# EAGLE design prototype (EAGLE 7.4.0)
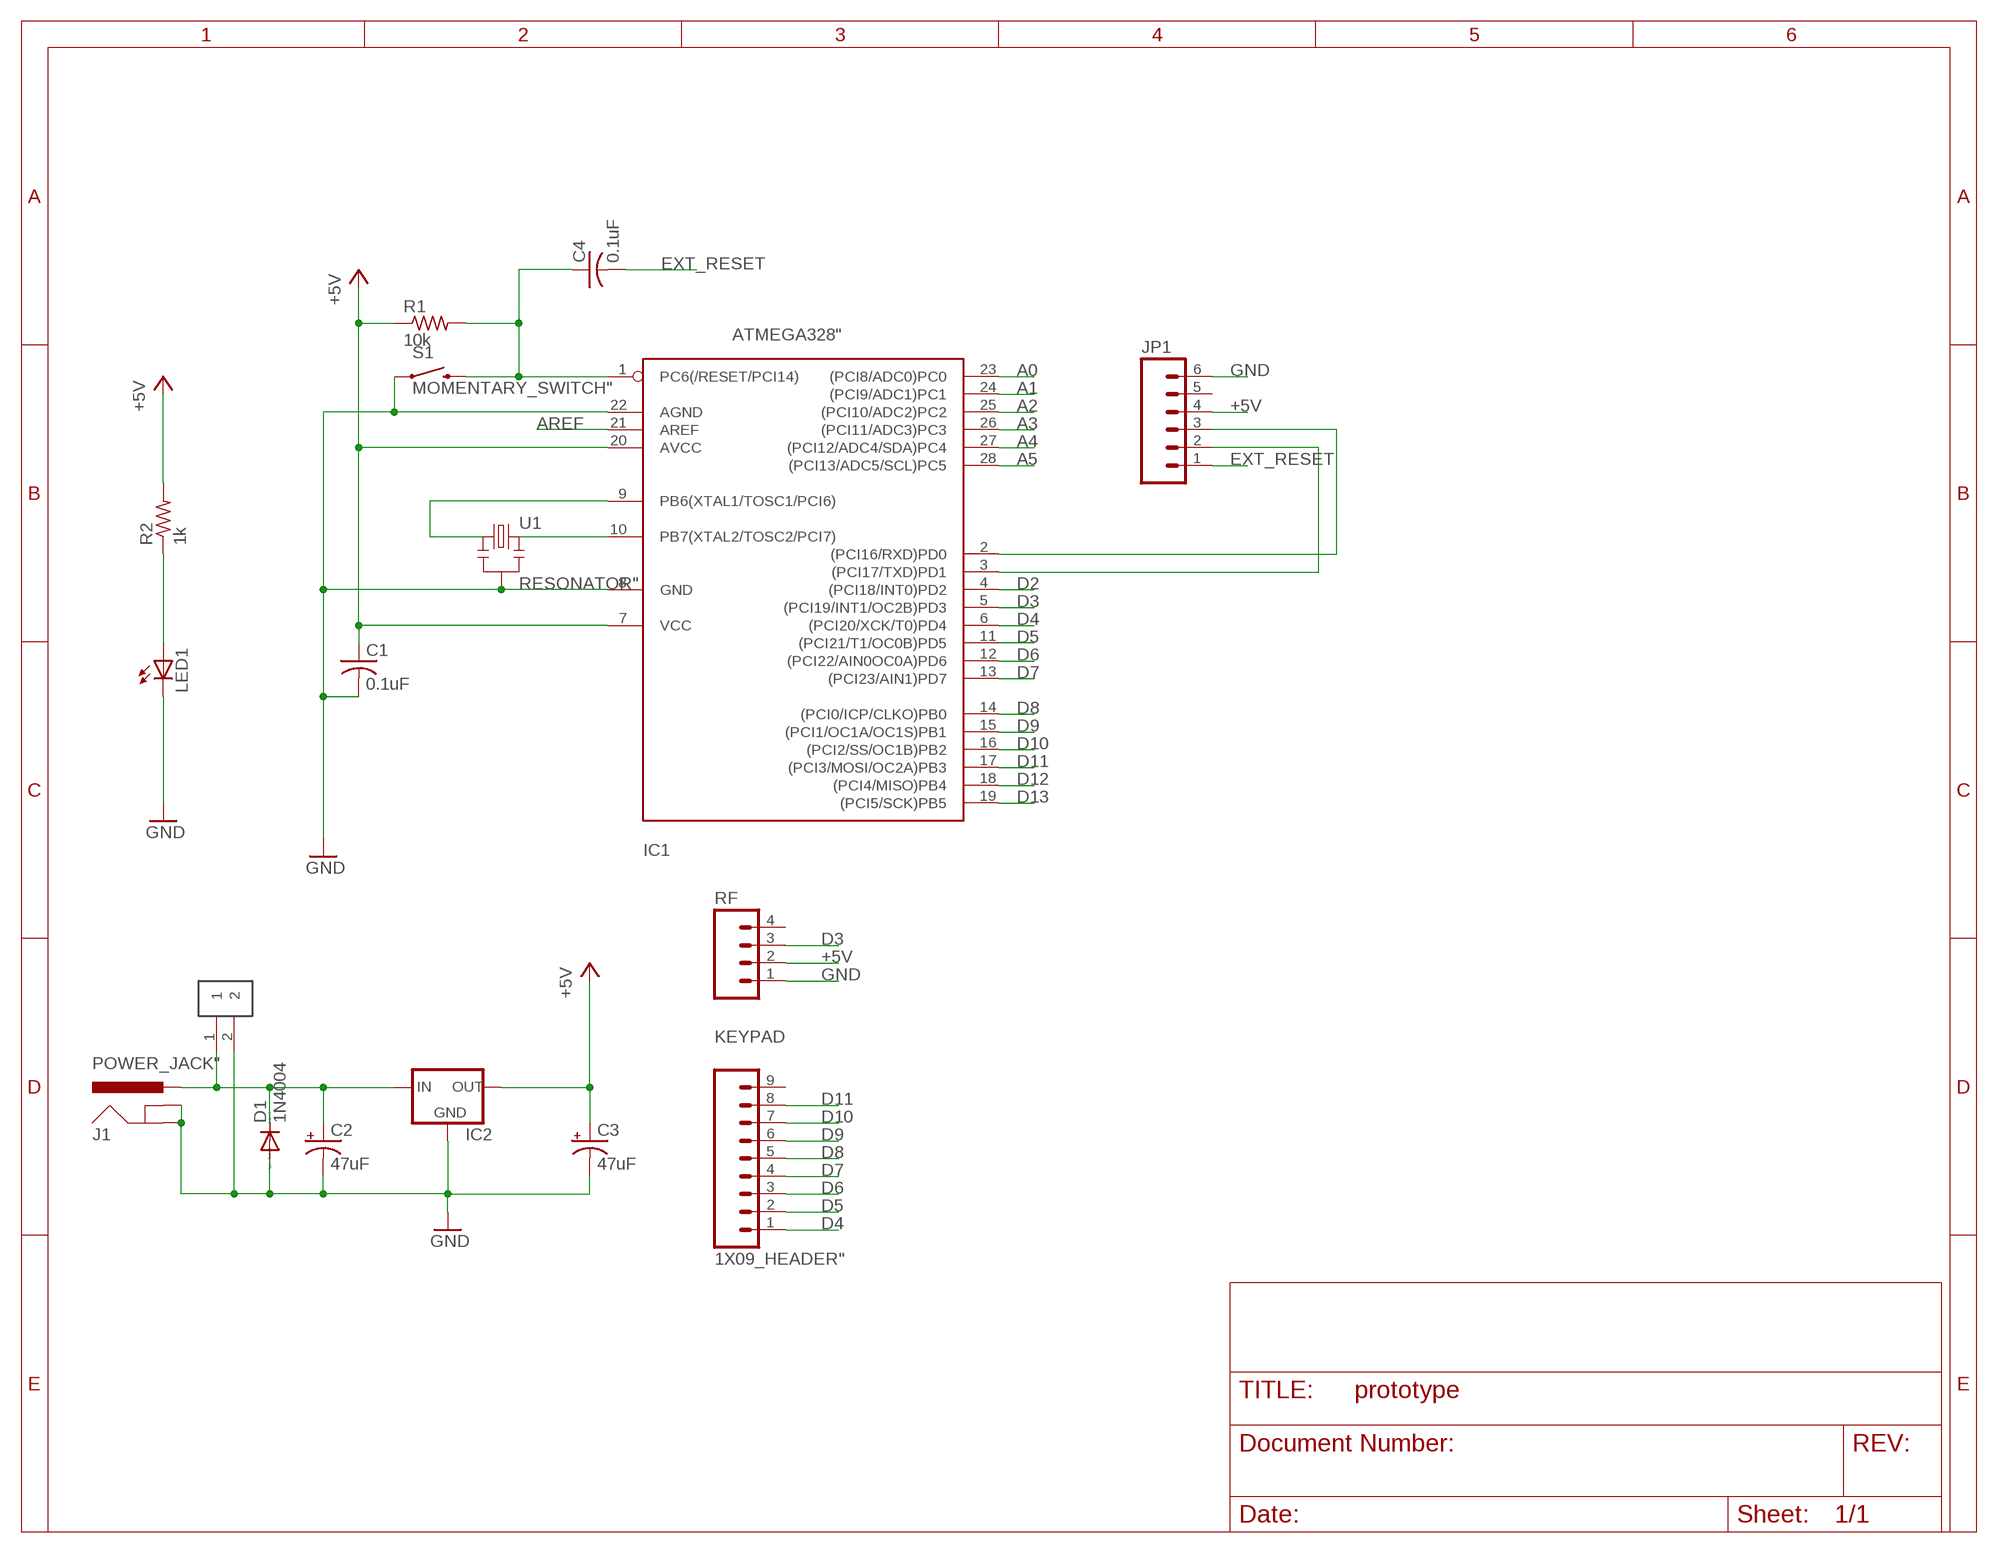
[diagram p0: schematic, sheet 1]

## Parts
C1  0.1uF  UNPOLARIZED_CAP"  [UNPOLARIZED_CAP]
C2  47uF  ELECTROLYTIC_CAP2.54MM  [ELECTROLYTIC_CAP]
C3  47uF  ELECTROLYTIC_CAP2.54MM  [ELECTROLYTIC_CAP]
C4  0.1uF  UNPOLARIZED_CAP"  [UNPOLARIZED_CAP]
D1  1N4004  [DO41-10]
IC1  ATMEGA328"  [ATMEGA328]
IC2  REGULATOR  [L4931_REGULATOR]
J1  POWER_JACK"  [POWER_JACK]
JP1  1X06_HEADER"  [1X06_HEADER]
KEYPAD  1X09_HEADER"  [1X09_HEADER]
LED1  LED3MM  [LED]
R1  10k  RESISTOR1/6WATT  [RESISTOR]
R2  1k  RESISTOR1/6WATT  [RESISTOR]
RF  1X04_HEADER"  [1X04_HEADER]
S1  MOMENTARY_SWITCH"  [MOMENTARY_SWITCH]
U1  RESONATOR"  [RESONATOR]
U$1  1X02_HEADER  [1X02_HEADER]

## Nets
+5V: C1.1 C3.+ IC1.7(VCC) IC1.20(AVCC) IC2.OUT JP1.4 R1.1 R2.2 RF.2
A0: IC1.23((PCI8/ADC0)PC0)
A1: IC1.24((PCI9/ADC1)PC1)
A2: IC1.25((PCI10/ADC2)PC2)
A3: IC1.26((PCI11/ADC3)PC3)
A4: IC1.27((PCI12/ADC4/SDA)PC4)
A5: IC1.28((PCI13/ADC5/SCL)PC5)
AREF: IC1.21(AREF)
D2: IC1.4((PCI18/INT0)PD2)
D3: IC1.5((PCI19/INT1/OC2B)PD3) RF.3
D4: IC1.6((PCI20/XCK/T0)PD4) KEYPAD.1
D5: IC1.11((PCI21/T1/OC0B)PD5) KEYPAD.2
D6: IC1.12((PCI22/AIN0OC0A)PD6) KEYPAD.3
D7: IC1.13((PCI23/AIN1)PD7) KEYPAD.4
D8: IC1.14((PCI0/ICP/CLKO)PB0) KEYPAD.5
D9: IC1.15((PCI1/OC1A/OC1S)PB1) KEYPAD.6
D10: IC1.16((PCI2/SS/OC1B)PB2) KEYPAD.7
D11: IC1.17((PCI3/MOSI/OC2A)PB3) KEYPAD.8
D12: IC1.18((PCI4/MISO)PB4)
D13: IC1.19((PCI5/SCK)PB5)
EXT_RESET: C4.2 JP1.1
GND: C1.2 C2.- C3.- D1.A IC1.8(GND) IC1.22(AGND) IC2.GND J1.GND J1.GNDBREAK JP1.6 LED1.K(C) RF.1 S1.1 U1.2 U$1.2
N$1: IC1.9(PB6(XTAL1/TOSC1/PCI6)) U1.1
N$2: IC1.10(PB7(XTAL2/TOSC2/PCI7)) U1.3
N$3: LED1.A R2.1
N$4: C4.1 IC1.1(PC6(/RESET/PCI14)) R1.2 S1.3
N$5: C2.+ D1.C IC2.IN J1.PWR U$1.1
N$7: IC1.2((PCI16/RXD)PD0) JP1.3
N$8: IC1.3((PCI17/TXD)PD1) JP1.2
Unconnected: JP1.5 KEYPAD.9 RF.4

## Library data of the parts
C1 C4 = RBBB:UNPOLARIZED_CAP: CAPACITOR, American symbol
C2 C3 = RBBB:ELECTROLYTIC_CAP: POLARIZED CAPACITOR, American symbol
D1 = diode:1N4004: DIODE general purpose rectifier, 1 A
IC1 = RBBB:ATMEGA328: MICROCONTROLLER 16 kBytes FLASH 1 kBytes SRAM 512 Bytes EEPROM USART 8-channel 10 bit ADC
IC2 = RBBB:REGULATOR: VOLTAGE REGULATOR
J1 = RBBB:POWER_JACK: Power Jack This is the standard 5.5mm barrel jack for power. The PTH is the most common, proven, reliable, footprint. All others are experimental. The Slot footprint only works if the mill layer is transmitted to the PCB fab house so be warned. Spark Fun Electronics SKU : PRT-00119. Mating wall wart : TOL-00298 (and others)
JP1 = RBBB:1X06_HEADER
KEYPAD = RBBB:1X09_HEADER: Header 9 Standard 9-pin 0.1" header. Use with straight break away headers (SKU : PRT-00116), right angle break away headers (PRT-00553), swiss pins (PRT-00743), machine pins (PRT-00117), and female headers (PRT-00115).
LED1 = RBBB:LED: LED OSRAM: - CHIPLED LG R971, LG N971, LY N971, LG Q971, LY Q971, LO R971, LY R971 LH N974, LH R974 LS Q976, LO Q976, LY Q976 LO Q996 - Hyper CHIPLED LW Q18S LB Q993, LB Q99A, LB R99A - SideLED LS A670, LO A670, LY A670, LG A670, LP A670 LB A673, LV A673, LT A673, LW A673 LH A674 LY A675 LS A676, LA A676, LO A676, LY A676, LW A676 LS A679, LY A679, LG A679 - Hyper Micro SIDELED® LS Y876, LA Y876, LO Y876, LY Y876 LT Y87S - SmartLED LW L88C, LW L88S LB L89C, LB L89S, LG L890 LS L89K, LO L89K, LY L89K LS L896, LA L896, LO L896, LY L896 - TOPLED LS T670, LO T670, LY T670, LG T670, LP T670 LSG T670, LSP T670, LSY T670, LOP T670, LYG T670 LG T671, LOG T671, LSG T671 LB T673, LV T673, LT T673, LW T673 LH T674 LS T676, LA T676, LO T676, LY T676, LB T676, LH T676, LSB T676, LW T676 LB T67C, LV T67C, LT T67C, LS T67K, LO T67K, LY T67K, LW E67C LS E67B, LA E67B, LO E67B, LY E67B, LB E67C, LV E67C, LT E67C LW T67C LS T679, LY T679, LG T679 LS T770, LO T770, LY T770, LG T770, LP T770 LB T773, LV T773, LT T773, LW T773 LH T774 LS E675, LA E675, LY E675, LS T675 LS T776, LA T776, LO T776, LY T776, LB T776 LHGB T686 LT T68C, LB T68C - Hyper Mini TOPLED® LB M676 - Mini TOPLED Santana® LG M470 LS M47K, LO M47K, LY M47K Source: http://www.osram.convergy.de LUXEON: - LUMILED® LXK2-PW12-R00, LXK2-PW12-S00, LXK2-PW14-U00, LXK2-PW14-V00 LXK2-PM12-R00, LXK2-PM12-S00, LXK2-PM14-U00 LXK2-PE12-Q00, LXK2-PE12-R00, LXK2-PE12-S00, LXK2-PE14-T00, LXK2-PE14-U00 LXK2-PB12-K00, LXK2-PB12-L00, LXK2-PB12-M00, LXK2-PB14-N00, LXK2-PB14-P00, LXK2-PB14-Q00 LXK2-PR12-L00, LXK2-PR12-M00, LXK2-PR14-Q00, LXK2-PR14-R00 LXK2-PD12-Q00, LXK2-PD12-R00, LXK2-PD12-S00 LXK2-PH12-R00, LXK2-PH12-S00 LXK2-PL12-P00, LXK2-PL12-Q00, LXK2-PL12-R00 Source: www.luxeon.com KINGBRIGHT: KA-3528ASYC Source: www.kingbright.com
R1 R2 = RBBB:RESISTOR: RESISTOR, American symbol
RF = RBBB:1X04_HEADER: Header 4 Standard 4-pin 0.1" header. Use with straight break away headers (SKU : PRT-00116), right angle break away headers (PRT-00553), swiss pins (PRT-00743), machine pins (PRT-00117), and female headers (PRT-00115). Molex polarized connector foot print use with SKU : PRT-08231 with associated crimp pins and housings.
S1 = RBBB:MOMENTARY_SWITCH
U1 = RBBB:RESONATOR: Resonator Small SMD resonator. This is the itty bitty 10/20MHz resonators with built in caps. CSTCE10M0G55 and CSTCE20M0V53. Footprint has been reviewed closely but hasn t been tested yet.'
U$1 = RBBB:1X02_HEADER

## Board
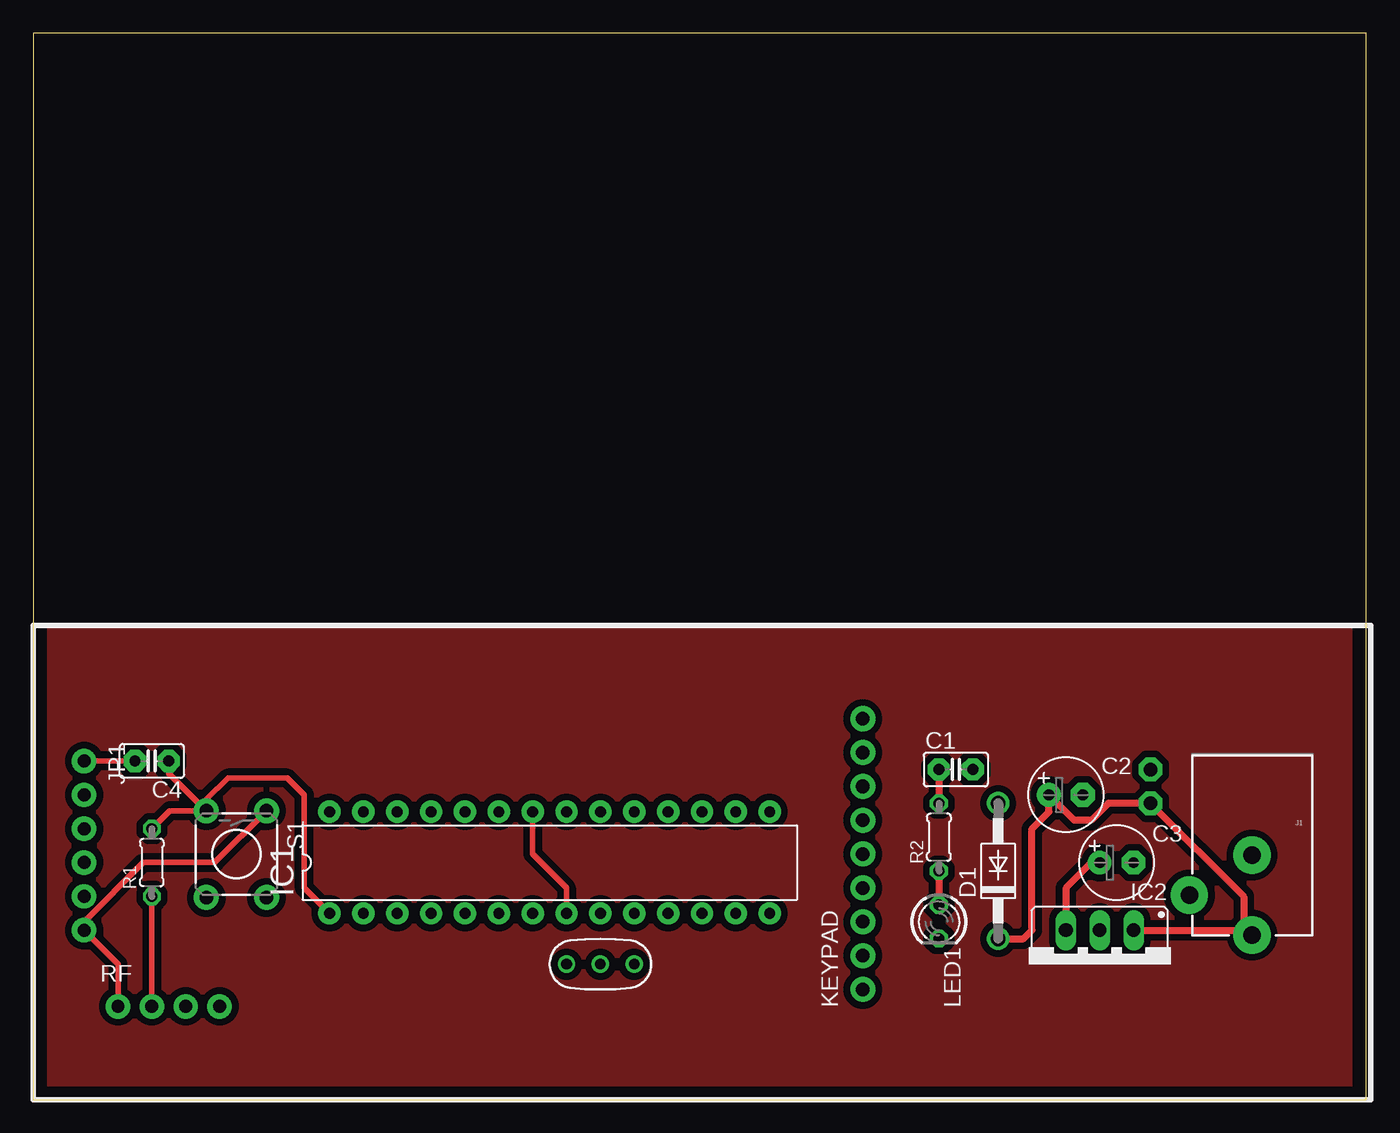
[diagram p1: board, top side]
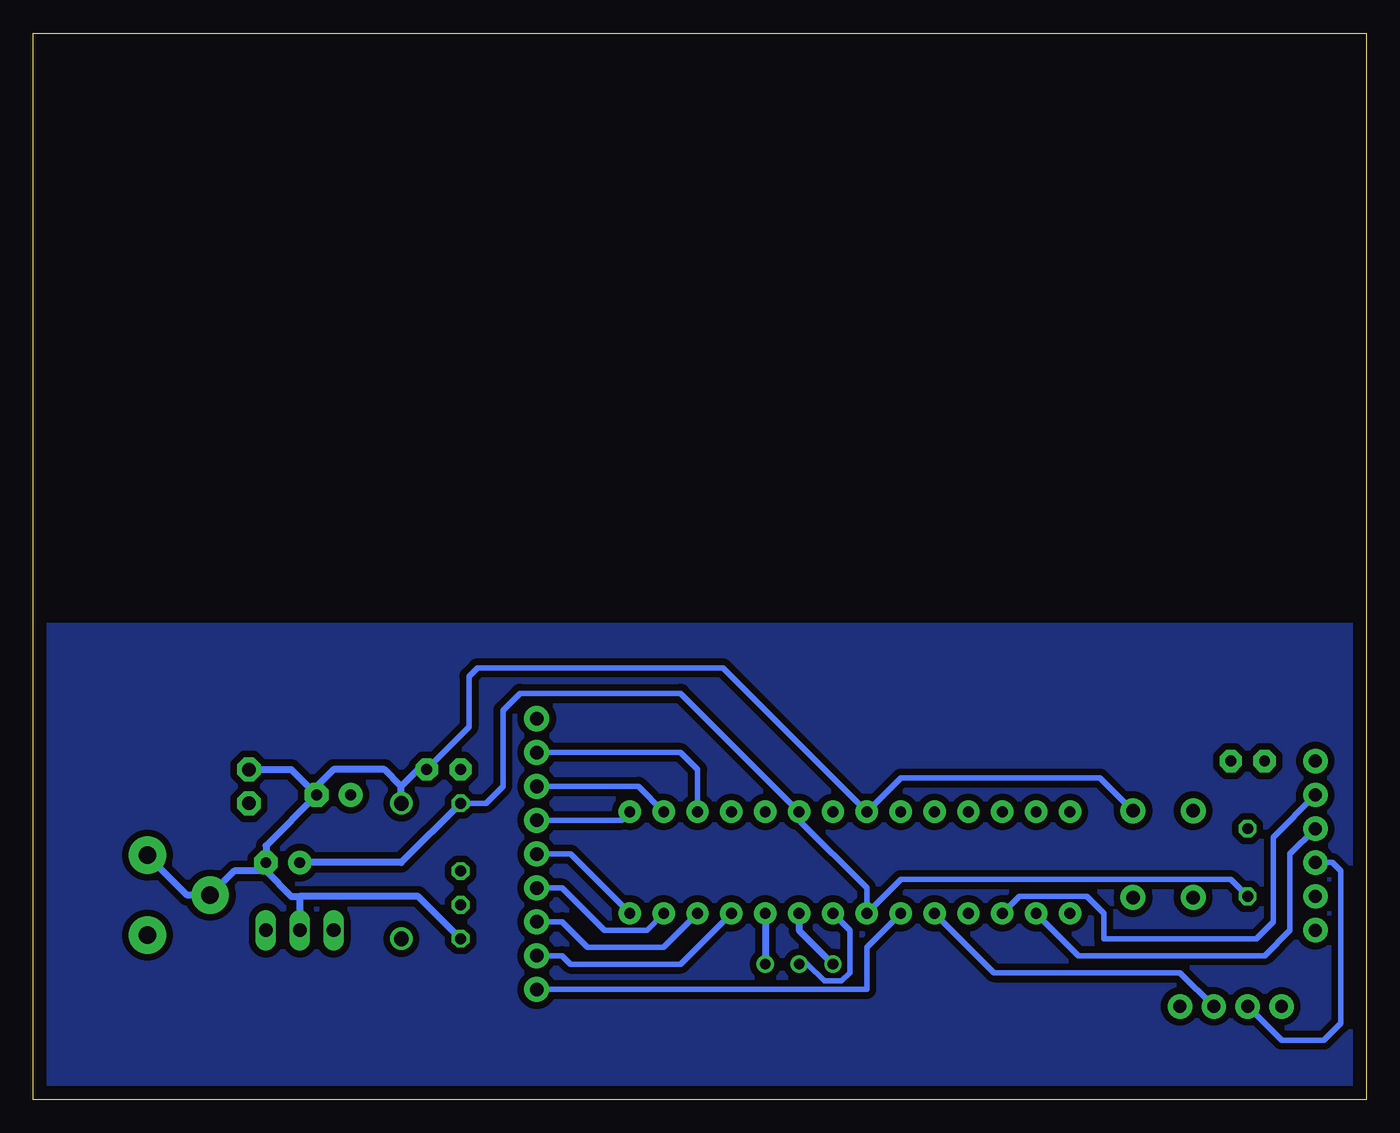
[diagram p2: board, bottom side, seen from below]

Size 100 x 80 mm. Coordinates in mm from the lower left corner, seen from the top.
Outline: 0,0 100,0 100,80 0,80 0,0
Copper layers (1*16): Top 0.035mm / dielectric 1.5mm / Bottom 0.035mm
Design rules "default": minimum track width 10mil, minimum drill 24mil, track to track 8mil, track to pad 8mil, pad to pad 8mil, via to via 8mil, smd to smd 8mil, copper to edge 40mil, drill to drill 8mil, minimum pad ring 10mil, minimum via ring 8mil, stop-mask expansion 4mil, vias tented up to drill 0mil, thermal gap 10mil

### Footprints (pad centres in the part's own frame; a part is rotated, then mirrored left to right if it is on the bottom)
UNPOLARIZED_CAP = drill 0.813 pad 1.676 octagon: 1 -1.27,0; 2 1.27,0
ELECTROLYTIC_CAP = drill 0.813 pad 1.778: + -1.27,0 | drill 0.813 pad 1.778 octagon: - 1.27,0
DO41-10 = drill 1.118: A 5.08,0; C -5.08,0
ATMEGA328 = drill 0.813 pad 1.676: 1 -16.51,-3.81; 2 -13.97,-3.81; 3 -11.43,-3.81; 4 -8.89,-3.81; 5 -6.35,-3.81; 6 -3.81,-3.81; 7 -1.27,-3.81; 8 1.27,-3.81; 9 3.81,-3.81; 10 6.35,-3.81; 11 8.89,-3.81; 12 11.43,-3.81; 13 13.97,-3.81; 14 16.51,-3.81; 15 16.51,3.81; 16 13.97,3.81; 17 11.43,3.81; 18 8.89,3.81; 19 6.35,3.81; 20 3.81,3.81; 21 1.27,3.81; 22 -1.27,3.81; 23 -3.81,3.81; 24 -6.35,3.81; 25 -8.89,3.81; 26 -11.43,3.81; 27 -13.97,3.81; 28 -16.51,3.81
L4931_REGULATOR = drill 1.016 long: GND 0,-2.54; IN -2.54,-2.54; OUT 2.54,-2.54
POWER_JACK = drill 1.321 pad 2.794: GND 0,7.7; GNDBREAK 4.7,10.7; PWR 0,13.7
1X06_HEADER = drill 0.965 pad 1.829: 1 0,0; 2 2.54,0; 3 5.08,0; 4 7.62,0; 5 10.16,0; 6 12.7,0
1X09_HEADER = drill 1.016 pad 1.88: 1 0,0; 2 2.54,0; 3 5.08,0; 4 7.62,0; 5 10.16,0; 6 12.7,0; 7 15.24,0; 8 17.78,0; 9 20.32,0
LED = drill 0.813 octagon: A -1.27,0; K 1.27,0
RESISTOR = drill 0.813 octagon: 1 -2.54,0; 2 2.54,0
1X04_HEADER = drill 0.965 pad 1.829: 1 0,0; 2 2.54,0; 3 5.08,0; 4 7.62,0
MOMENTARY_SWITCH = drill 1.016 pad 1.88: 1 -3.251,2.261; 2 3.251,2.261; 3 -3.251,-2.261; 4 3.251,-2.261
RESONATOR = drill 0.8: 1 -2.54,0; 2 0,0; 3 2.54,0
1X02_HEADER = drill 1.016 pad 1.778 octagon: 1 -1.27,0; 2 1.27,0

### Placement (x,y rotation side)
C1  69.22,24.77 0 top
C2  77.47,22.86 0 top
C3  81.28,17.78 0 top
C4  8.89,25.4 180 top
D1  72.39,17.14 90 top
IC1  38.73,17.78 0 top
IC2  80.01,10.16 180 top
J1  91.44,26.04 180 top
JP1  3.81,25.4 270 top
KEYPAD  62.23,8.26 90 top
LED1  67.94,13.34 270 top
R1  8.89,17.78 90 top
R2  67.94,19.68 90 top
RF  6.35,6.99 0 top
S1  15.24,18.41 270 top
U1  42.55,10.16 0 top
U$1  83.82,23.5 90 top

### Tracks (layer width: path | path; a pad name or v marks a point on that pad's centre or on a via)
+5V
  Top 0.406: R1.1 RF.2
  Top 0.508: C3.+ 79.38,17.78 77.47,15.88 IC2.OUT | C1.1 R2.2
  Bottom 0.406: R2.2 66.04,22.23 64.77,23.5 64.77,29.21 63.5,30.48 51.44,30.48 IC1.20 42.55,20.95 37.47,15.88 IC1.7 34.92,16.51 10.16,16.51 R1.1 | JP1.4 2.54,17.78 1.91,17.14 1.91,5.71 3.17,4.45 6.35,4.45 RF.2
  Bottom 0.508: R2.2 72.39,17.78 C3.+
D3
  Bottom 0.406: IC1.5 27.94,9.53 13.97,9.53 RF.3
D4
  Bottom 0.406: KEYPAD.1 37.47,8.26 37.47,11.43 IC1.6
D5
  Bottom 0.406: KEYPAD.2 60.33,10.79 59.69,10.16 51.44,10.16 IC1.11
D6
  Bottom 0.406: KEYPAD.3 60.33,13.34 58.42,11.43 52.7,11.43 IC1.12
D7
  Bottom 0.406: IC1.13 53.98,12.7 57.15,12.7 60.33,15.88 KEYPAD.4
D8
  Bottom 0.406: KEYPAD.5 59.69,18.41 IC1.14
D9
  Bottom 0.406: KEYPAD.6 55.88,20.95 IC1.15
D10
  Bottom 0.406: KEYPAD.7 54.61,23.5 IC1.16
D11
  Bottom 0.406: IC1.17 50.16,24.77 51.44,26.04 KEYPAD.8
EXT_RESET
  Top 0.406: C4.2 JP1.1
GND
  Top 0.406: RF.1 6.35,10.16 JP1.6 3.81,13.34 8.26,17.78 13.61,17.78 S1.1 | IC1.22 37.47,18.41 40.01,15.88 IC1.8
  Bottom 0.406: U1.2 41.91,10.16 40.64,8.89 39.37,8.89 38.73,9.53 38.73,12.7 IC1.8 | C1.2 67.31,27.94 67.31,31.75 66.67,32.38 48.26,32.38 IC1.22 34.92,24.13 19.96,24.13 S1.1
  Bottom 0.508: D1.A 72.39,23.5 | 72.39,23.5 73.66,24.77 77.47,24.77 78.74,23.5 C2.- | U$1.2 80.64,24.77 C2.- | C2.- 82.55,19.05 C3.- 82.55,17.14 | 82.55,17.14 80.64,15.24 80.01,15.24 | 80.01,15.24 IC2.GND | 82.55,17.14 84.93,17.14 J1.GNDBREAK 88.44,15.34 J1.GND | LED1.K 71.12,15.24 80.01,15.24 | C1.2 71.12,24.77 72.39,23.5
N$1
  Bottom 0.508: IC1.9 42.55,12.7 U1.1
N$2
  Bottom 0.508: IC1.10 U1.3
N$3
  Top 0.508: R2.1 LED1.A
N$4
  Top 0.406: C4.1 10.16,24.49 S1.3 | S1.3 10.24,21.67 R1.2 | IC1.1 20.32,15.88 20.32,22.86 19.05,24.13 14.61,24.13 12.98,22.5 S1.3
N$5
  Top 0.508: IC2.IN 91.08,12.7 J1.PWR 90.81,12.97 90.81,15.24 U$1.1 80.64,22.23 79.38,20.95 78.11,20.95 C2.+ 76.2,21.59 74.93,20.32 74.93,12.7 74.3,12.06 D1.C
N$6
  pour Bottom (isolate 0.508): 0,35.56 0,0 100.33,0 100.33,35.56
N$7
  Bottom 0.406: JP1.3 5.71,18.41 5.71,12.7 7.62,10.79 21.59,10.79 IC1.2
N$8
  Bottom 0.406: JP1.2 6.99,19.68 6.99,13.34 8.26,12.06 19.68,12.06 19.68,13.97 20.95,15.24 26.04,15.24 IC1.3
N$9
  pour Top (isolate 0.508): 0,35.56 100.33,35.56 100.33,0 0,0